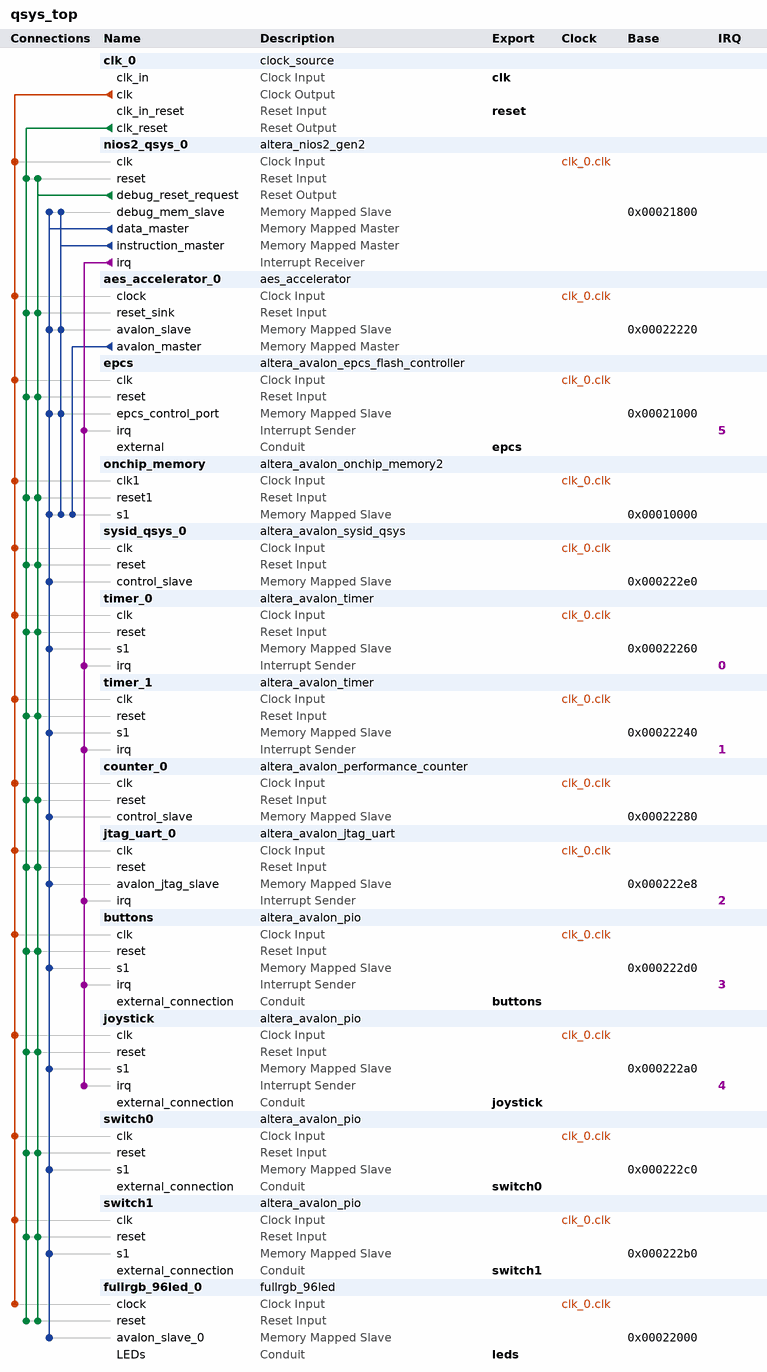
[diagram p0: system contents]
# Platform Designer (Qsys) system qsys_top, Cyclone IV E EP4CE22F17C6
# Parameters at their usual value, and those the tool derives, are not listed.
package require -exact qsys 15.0
create_system qsys_top
set_project_property DEVICE_FAMILY {Cyclone IV E}
set_project_property DEVICE EP4CE22F17C6

add_instance clk_0 clock_source 15.0
set_instance_parameter_value clk_0 clockFrequency 50000000

add_instance nios2_qsys_0 altera_nios2_gen2 15.0
set_instance_parameter_value nios2_qsys_0 dcache_size 0
set_instance_parameter_value nios2_qsys_0 exceptionSlave onchip_memory.s1
set_instance_parameter_value nios2_qsys_0 icache_size 4096
set_instance_parameter_value nios2_qsys_0 impl Fast
set_instance_parameter_value nios2_qsys_0 resetSlave epcs.epcs_control_port
set_instance_parameter_value nios2_qsys_0 setting_activateTrace true

add_instance aes_accelerator_0 aes_accelerator 1.0

add_instance epcs altera_avalon_epcs_flash_controller 15.0
set_instance_parameter_value epcs resetrequest_enabled true

add_instance onchip_memory altera_avalon_onchip_memory2 15.0
set_instance_parameter_value onchip_memory dataWidth 32
set_instance_parameter_value onchip_memory dualPort false
set_instance_parameter_value onchip_memory initMemContent true
set_instance_parameter_value onchip_memory initializationFileName onchip_memory
set_instance_parameter_value onchip_memory memorySize 49152

add_instance sysid_qsys_0 altera_avalon_sysid_qsys 15.0
set_instance_parameter_value sysid_qsys_0 id 0

add_instance timer_0 altera_avalon_timer 15.0
set_instance_parameter_value timer_0 period 1
set_instance_parameter_value timer_0 periodUnits MSEC

add_instance timer_1 altera_avalon_timer 15.0
set_instance_parameter_value timer_1 period 1
set_instance_parameter_value timer_1 periodUnits MSEC

add_instance counter_0 altera_avalon_performance_counter 15.0
set_instance_parameter_value counter_0 numberOfSections 1

add_instance jtag_uart_0 altera_avalon_jtag_uart 15.0
set_instance_parameter_value jtag_uart_0 readBufferDepth 256
set_instance_parameter_value jtag_uart_0 simInteractiveOptions INTERACTIVE_ASCII_OUTPUT
set_instance_parameter_value jtag_uart_0 writeBufferDepth 256

add_instance buttons altera_avalon_pio 15.0
set_instance_parameter_value buttons bitClearingEdgeCapReg true
set_instance_parameter_value buttons captureEdge true
set_instance_parameter_value buttons direction InOut
set_instance_parameter_value buttons edgeType FALLING
set_instance_parameter_value buttons generateIRQ true
set_instance_parameter_value buttons irqType EDGE
set_instance_parameter_value buttons width 4

add_instance joystick altera_avalon_pio 15.0
set_instance_parameter_value joystick bitClearingEdgeCapReg true
set_instance_parameter_value joystick captureEdge true
set_instance_parameter_value joystick direction Input
set_instance_parameter_value joystick edgeType FALLING
set_instance_parameter_value joystick generateIRQ true
set_instance_parameter_value joystick width 5

add_instance switch0 altera_avalon_pio 15.0
set_instance_parameter_value switch0 direction Bidir
set_instance_parameter_value switch0 width 8

add_instance switch1 altera_avalon_pio 15.0
set_instance_parameter_value switch1 direction Bidir
set_instance_parameter_value switch1 width 8

add_instance fullrgb_96led_0 fullrgb_96led 1.0
set_instance_parameter_value fullrgb_96led_0 CLK_FREQ 50000000
set_instance_parameter_value fullrgb_96led_0 FRAME_RATE 100

# connections
add_connection clk_0.clk aes_accelerator_0.clock clock
add_connection clk_0.clk buttons.clk clock
add_connection clk_0.clk counter_0.clk clock
add_connection clk_0.clk epcs.clk clock
add_connection clk_0.clk fullrgb_96led_0.clock clock
add_connection clk_0.clk joystick.clk clock
add_connection clk_0.clk jtag_uart_0.clk clock
add_connection clk_0.clk nios2_qsys_0.clk clock
add_connection clk_0.clk onchip_memory.clk1 clock
add_connection clk_0.clk switch0.clk clock
add_connection clk_0.clk switch1.clk clock
add_connection clk_0.clk sysid_qsys_0.clk clock
add_connection clk_0.clk timer_0.clk clock
add_connection clk_0.clk timer_1.clk clock
add_connection clk_0.clk_reset aes_accelerator_0.reset_sink reset
add_connection clk_0.clk_reset buttons.reset reset
add_connection clk_0.clk_reset counter_0.reset reset
add_connection clk_0.clk_reset epcs.reset reset
add_connection clk_0.clk_reset fullrgb_96led_0.reset reset
add_connection clk_0.clk_reset joystick.reset reset
add_connection clk_0.clk_reset jtag_uart_0.reset reset
add_connection clk_0.clk_reset nios2_qsys_0.reset reset
add_connection clk_0.clk_reset onchip_memory.reset1 reset
add_connection clk_0.clk_reset switch0.reset reset
add_connection clk_0.clk_reset switch1.reset reset
add_connection clk_0.clk_reset sysid_qsys_0.reset reset
add_connection clk_0.clk_reset timer_0.reset reset
add_connection clk_0.clk_reset timer_1.reset reset
add_connection nios2_qsys_0.debug_reset_request aes_accelerator_0.reset_sink reset
add_connection nios2_qsys_0.debug_reset_request buttons.reset reset
add_connection nios2_qsys_0.debug_reset_request counter_0.reset reset
add_connection nios2_qsys_0.debug_reset_request epcs.reset reset
add_connection nios2_qsys_0.debug_reset_request fullrgb_96led_0.reset reset
add_connection nios2_qsys_0.debug_reset_request joystick.reset reset
add_connection nios2_qsys_0.debug_reset_request jtag_uart_0.reset reset
add_connection nios2_qsys_0.debug_reset_request nios2_qsys_0.reset reset
add_connection nios2_qsys_0.debug_reset_request onchip_memory.reset1 reset
add_connection nios2_qsys_0.debug_reset_request switch0.reset reset
add_connection nios2_qsys_0.debug_reset_request switch1.reset reset
add_connection nios2_qsys_0.debug_reset_request sysid_qsys_0.reset reset
add_connection nios2_qsys_0.debug_reset_request timer_0.reset reset
add_connection nios2_qsys_0.debug_reset_request timer_1.reset reset
add_connection aes_accelerator_0.avalon_master onchip_memory.s1 avalon
set_connection_parameter_value aes_accelerator_0.avalon_master/onchip_memory.s1 baseAddress 0x00010000
add_connection nios2_qsys_0.data_master aes_accelerator_0.avalon_slave avalon
set_connection_parameter_value nios2_qsys_0.data_master/aes_accelerator_0.avalon_slave baseAddress 0x00022220
add_connection nios2_qsys_0.data_master buttons.s1 avalon
set_connection_parameter_value nios2_qsys_0.data_master/buttons.s1 baseAddress 0x000222d0
add_connection nios2_qsys_0.data_master counter_0.control_slave avalon
set_connection_parameter_value nios2_qsys_0.data_master/counter_0.control_slave baseAddress 0x00022280
add_connection nios2_qsys_0.data_master epcs.epcs_control_port avalon
set_connection_parameter_value nios2_qsys_0.data_master/epcs.epcs_control_port baseAddress 0x00021000
add_connection nios2_qsys_0.data_master fullrgb_96led_0.avalon_slave_0 avalon
set_connection_parameter_value nios2_qsys_0.data_master/fullrgb_96led_0.avalon_slave_0 baseAddress 0x00022000
add_connection nios2_qsys_0.data_master joystick.s1 avalon
set_connection_parameter_value nios2_qsys_0.data_master/joystick.s1 baseAddress 0x000222a0
add_connection nios2_qsys_0.data_master jtag_uart_0.avalon_jtag_slave avalon
set_connection_parameter_value nios2_qsys_0.data_master/jtag_uart_0.avalon_jtag_slave baseAddress 0x000222e8
add_connection nios2_qsys_0.data_master nios2_qsys_0.debug_mem_slave avalon
set_connection_parameter_value nios2_qsys_0.data_master/nios2_qsys_0.debug_mem_slave baseAddress 0x00021800
add_connection nios2_qsys_0.data_master onchip_memory.s1 avalon
set_connection_parameter_value nios2_qsys_0.data_master/onchip_memory.s1 baseAddress 0x00010000
add_connection nios2_qsys_0.data_master switch0.s1 avalon
set_connection_parameter_value nios2_qsys_0.data_master/switch0.s1 baseAddress 0x000222c0
add_connection nios2_qsys_0.data_master switch1.s1 avalon
set_connection_parameter_value nios2_qsys_0.data_master/switch1.s1 baseAddress 0x000222b0
add_connection nios2_qsys_0.data_master sysid_qsys_0.control_slave avalon
set_connection_parameter_value nios2_qsys_0.data_master/sysid_qsys_0.control_slave baseAddress 0x000222e0
add_connection nios2_qsys_0.data_master timer_0.s1 avalon
set_connection_parameter_value nios2_qsys_0.data_master/timer_0.s1 baseAddress 0x00022260
add_connection nios2_qsys_0.data_master timer_1.s1 avalon
set_connection_parameter_value nios2_qsys_0.data_master/timer_1.s1 baseAddress 0x00022240
add_connection nios2_qsys_0.instruction_master aes_accelerator_0.avalon_slave avalon
set_connection_parameter_value nios2_qsys_0.instruction_master/aes_accelerator_0.avalon_slave baseAddress 0x00022220
add_connection nios2_qsys_0.instruction_master epcs.epcs_control_port avalon
set_connection_parameter_value nios2_qsys_0.instruction_master/epcs.epcs_control_port baseAddress 0x00021000
add_connection nios2_qsys_0.instruction_master nios2_qsys_0.debug_mem_slave avalon
set_connection_parameter_value nios2_qsys_0.instruction_master/nios2_qsys_0.debug_mem_slave baseAddress 0x00021800
add_connection nios2_qsys_0.instruction_master onchip_memory.s1 avalon
set_connection_parameter_value nios2_qsys_0.instruction_master/onchip_memory.s1 baseAddress 0x00010000
add_connection nios2_qsys_0.irq buttons.irq interrupt
set_connection_parameter_value nios2_qsys_0.irq/buttons.irq irqNumber 3
add_connection nios2_qsys_0.irq epcs.irq interrupt
set_connection_parameter_value nios2_qsys_0.irq/epcs.irq irqNumber 5
add_connection nios2_qsys_0.irq joystick.irq interrupt
set_connection_parameter_value nios2_qsys_0.irq/joystick.irq irqNumber 4
add_connection nios2_qsys_0.irq jtag_uart_0.irq interrupt
set_connection_parameter_value nios2_qsys_0.irq/jtag_uart_0.irq irqNumber 2
add_connection nios2_qsys_0.irq timer_0.irq interrupt
set_connection_parameter_value nios2_qsys_0.irq/timer_0.irq irqNumber 0
add_connection nios2_qsys_0.irq timer_1.irq interrupt
set_connection_parameter_value nios2_qsys_0.irq/timer_1.irq irqNumber 1

# exported interfaces
add_interface buttons conduit end
set_interface_property buttons EXPORT_OF buttons.external_connection
add_interface clk clock sink
set_interface_property clk EXPORT_OF clk_0.clk_in
add_interface epcs conduit end
set_interface_property epcs EXPORT_OF epcs.external
add_interface joystick conduit end
set_interface_property joystick EXPORT_OF joystick.external_connection
add_interface leds conduit end
set_interface_property leds EXPORT_OF fullrgb_96led_0.LEDs
add_interface reset reset sink
set_interface_property reset EXPORT_OF clk_0.clk_in_reset
add_interface switch0 conduit end
set_interface_property switch0 EXPORT_OF switch0.external_connection
add_interface switch1 conduit end
set_interface_property switch1 EXPORT_OF switch1.external_connection

set_interconnect_requirement {$system} qsys_mm.clockCrossingAdapter HANDSHAKE
set_interconnect_requirement {$system} qsys_mm.maxAdditionalLatency 1

save_system qsys_top.qsys
